# EAGLE design SparkFun_MOSFET_Power_Switch_and_Buck_Regulator_Low-Side (EAGLE 9.6.2)
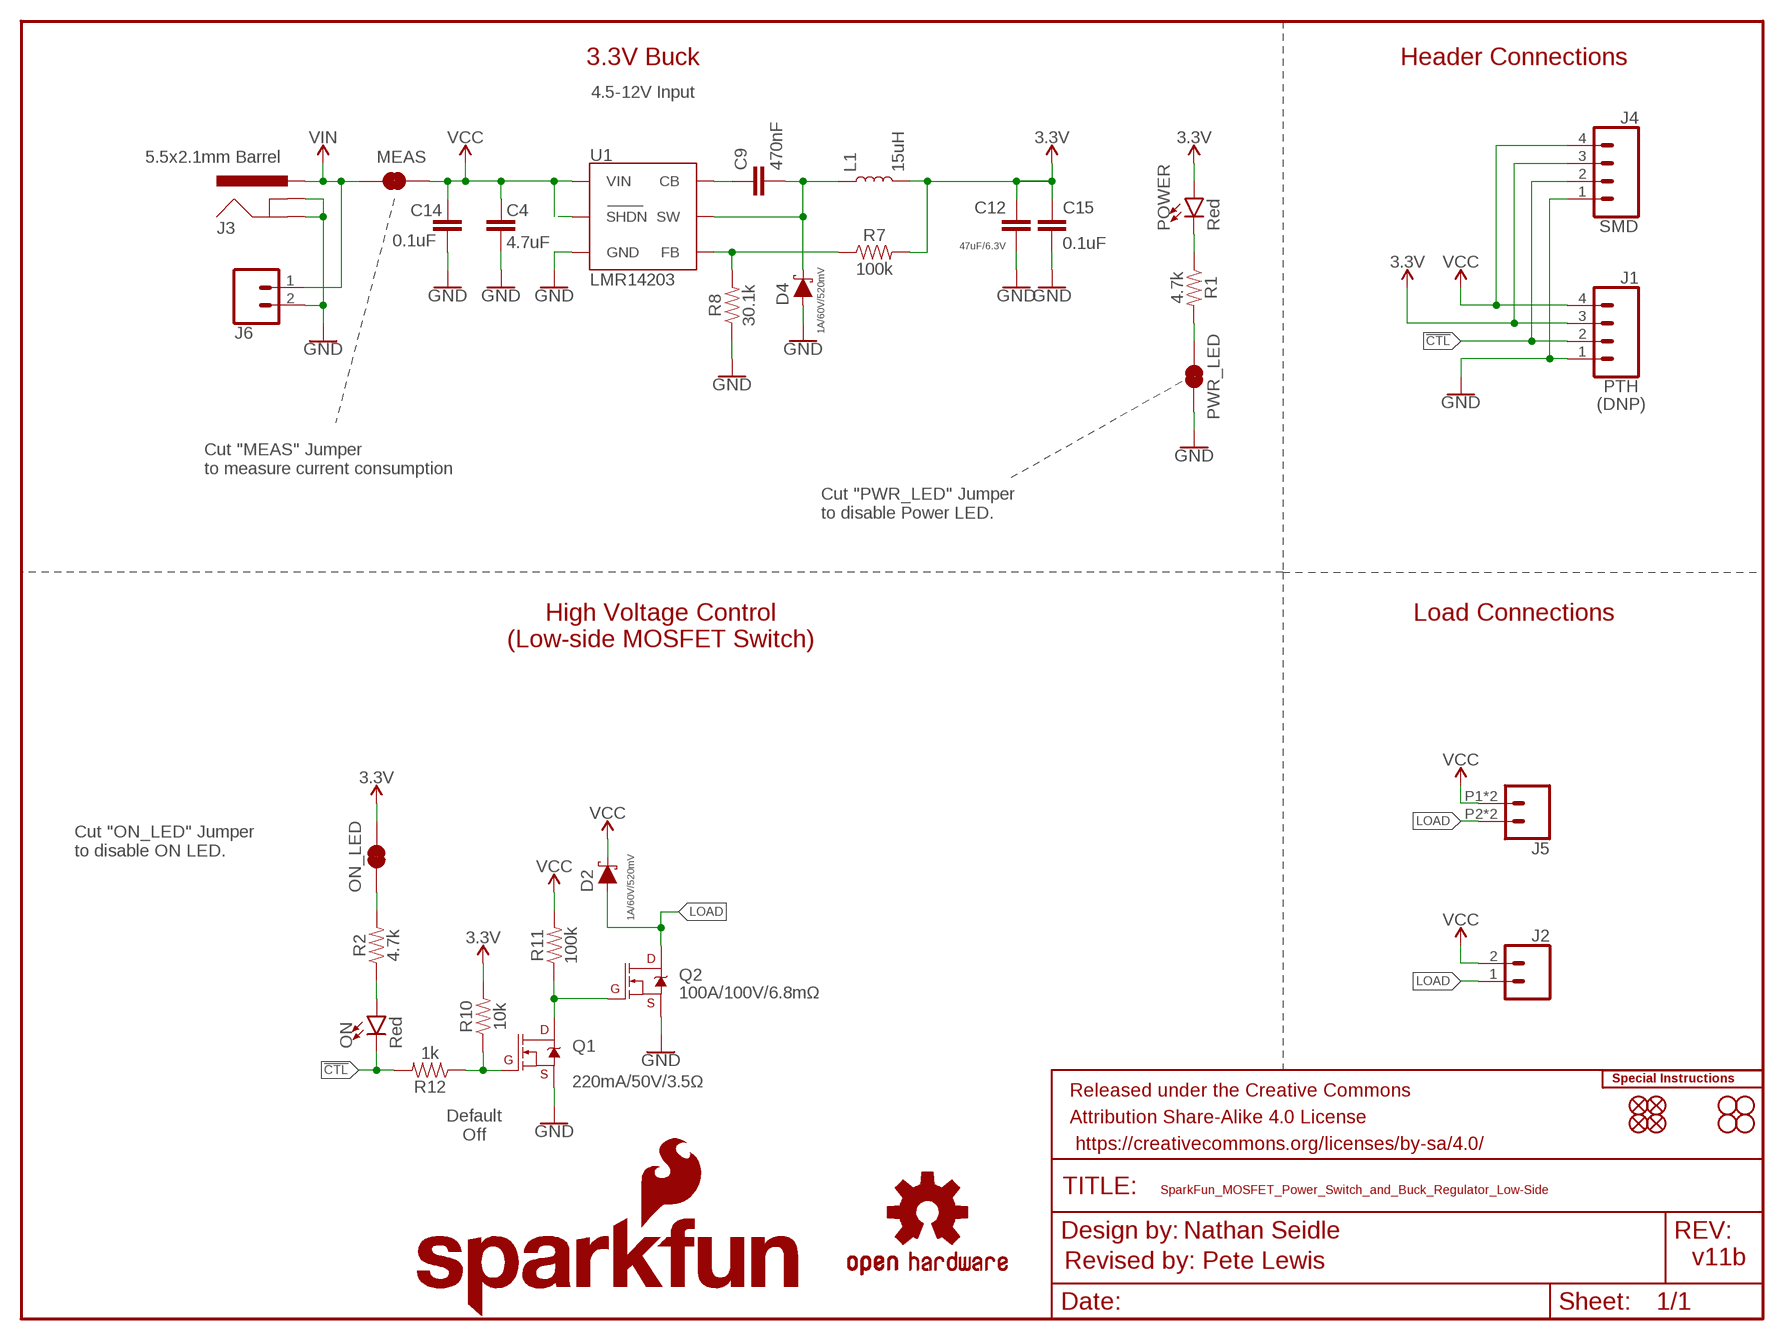
[diagram p0: schematic, sheet 1]

## Parts
C4  4.7uF  4.7UF-0603-35V-(20%)  [0603]
C9  470nF  470NF-0603-10V-10%-X5R  [0603]
C12  47uF/6.3V  47UF  [0805]
C14  0.1uF  0.1UF-0603-100V-10%  [0603]
C15  0.1uF  0.1UF-0603-100V-10%  [0603]
D2  1A/60V/520mV  DIODE-SCHOTTKY-MSS1P6-M3/89A  [DIODE-MICRO-SMP]
D4  1A/60V/520mV  DIODE-SCHOTTKY-MSS1P6-M3/89A  [DIODE-MICRO-SMP]
FD1  FIDUCIALUFIDUCIAL  [FIDUCIAL-MICRO]
FD2  FIDUCIALUFIDUCIAL  [FIDUCIAL-MICRO]
FD3  FIDUCIALUFIDUCIAL  [FIDUCIAL-MICRO]
FD4  FIDUCIALUFIDUCIAL  [FIDUCIAL-MICRO]
FRAME2  FRAME-LETTER  [CREATIVE_COMMONS]
H1  STAND-OFF  [STAND-OFF]
H2  STAND-OFF  [STAND-OFF]
H3  STAND-OFF  [STAND-OFF]
H4  STAND-OFF  [STAND-OFF]
J1  PTH  CONN_041X04_NO_SILK_NO_POP  [1X04_NO_SILK]
J2  CONN_021X02_NO_SILK  [1X02_NO_SILK]
J3  5.5x2.1mm Barrel  POWER_JACKSMD  [POWER_JACK_SMD]
J4  SMD  CONN_04SMD_STRAIGHT_COMBO  [1X04_SMD_VERTICAL_COMBO]
J5  CONN_02SMALL_POKEHOME  [1X02_POKEHOME]
J6  CONN_021X02_NO_SILK  [1X02_NO_SILK]
L1  15uH  INDUCTOR-LHQ32-15UH  [INDUCTOR_LQH32]
LOGO1  OSHW-LOGOM  [OSHW-LOGO-M]
LOGO2  SFE_LOGO_NAME_FLAME.2_INCH  [SFE_LOGO_NAME_FLAME_.2]
LOGO3  SPECIAL_INSTRUCTIONS-ORDERING  [ORDERING_INSTRUCTIONS]
MEAS  JUMPER-COMBO_2_NC_TRACE  [COMBO-JUMPER_2_NC_TRACE]
ON  Red  LED-RED_0603-KB  [LED-0603]
ON_LED  JUMPER-SMT_2_NC_TRACE_SILK  [SMT-JUMPER_2_NC_TRACE_SILK]
POWER  Red  LED-RED_0603-KB  [LED-0603]
PWR_LED  JUMPER-SMT_2_NC_TRACE_SILK  [SMT-JUMPER_2_NC_TRACE_SILK]
Q1  220mA/50V/3.5Ω  MOSFET-NCH-BSS138  [SOT23-3]
Q2  100A/100V/6.8mΩ  MOSFET-NCH-PSMN7R0  [TO-263/D2PAK]
R1  4.7k  4.7KOHM-0603-1/10W-1%  [0603]
R2  4.7k  4.7KOHM-0603-1/10W-1%  [0603]
R7  100k  100KOHM-0603-1/10W-1%  [0603]
R8  30.1k  30.1KOHM-0603-1/10W-1%  [0603]
R10  10k  10KOHM-0603-1/10W-1%  [0603]
R11  100k  100KOHM-0603-1/10W-1%  [0603]
R12  1k  1KOHM-0603-1/10W-1%  [0603]
U1  LMR14203  [SOT23-6]

## Nets
3.3V: C12.1 C15.1 J1.3 J4.3 L1.P$2 ON_LED.2 POWER.A R7.2 R10.2
!CTL: J1.2 J4.2 ON.C R12.2
GND [power]: C4.2 C12.2 C14.2 C15.2 D4.A J1.1 J3.GND(GNDBREAK) J3.P$4(GND) J4.1 J6.2 PWR_LED.1 Q1.2(S) Q2.3(S) R8.1 U1.2(GND)
LOAD: D2.A J2.1 J5.P2 J5.P4 Q2.2(D)
N$1: Q1.3(D) Q2.1(G) R11.1
N$2: ON.A R2.1
N$3: POWER.C R1.1
N$5: R7.1 R8.2 U1.3(FB)
N$6 [power]: PWR_LED.2 R1.2
N$7: ON_LED.1 R2.2
N$10: C9.1 U1.1(CB)
N$12: Q1.1(G) R10.1 R12.1
VCC: C4.1 C14.1 D2.C J1.4 J2.2 J4.4 J5.P1 J5.P3 MEAS.2 MEAS.4 R11.2 U1.4(SHDN) U1.5(VIN)
VIN: J3.VIN0(PWR) J6.1 MEAS.1 MEAS.3
VSW: C9.2 D4.C L1.P$1 U1.6(SW)

## Notes on the sheet
- 3.3V Buck | Header Connections
- 4.5-12V Input
- (DNP)
- Cut "MEAS" Jumper 
  to measure current consumption
- Cut "PWR_LED" Jumper 
  to disable Power LED.
- High Voltage Control
  (Low-side MOSFET Switch)
- Load Connections
- Cut "ON_LED" Jumper 
  to disable ON LED.
- Default
  Off
- Nathan Seidle
- Revised by: Pete Lewis | v11b

## Library data of the parts
C4 = SparkFun-Capacitors:4.7UF: 4.7µF ceramic capacitors A capacitor is a passive two-terminal electrical component used to store electrical energy temporarily in an electric field.; PROD_ID: CAP-14106
C9 = SparkFun-Capacitors:470NF: 0.47uF/470nF ceramic capacitors A capacitor is a passive two-terminal electrical component used to store electrical energy temporarily in an electric field.; PROD_ID: CAP-13216
C12 = SparkFun-Capacitors:47UF; PROD_ID: CAP-13854
C14 C15 = SparkFun-Capacitors:0.1UF: 0.1µF ceramic capacitors A capacitor is a passive two-terminal electrical component used to store electrical energy temporarily in an electric field.; PROD_ID: CAP-08390
D2 D4 = SparkFun-DiscreteSemi:DIODE-SCHOTTKY: Schottky diode A Schottky diode is a semiconductor diode which has a low forward voltage drop and a very fast switching action.; PROD_ID: DIO-13919
FD1-FD4 = SparkFun-Aesthetics:FIDUCIAL: Fiducial Alignment Points Point-of-reference for pick-and-place machines and other optical instruments.
FRAME2 = SparkFun-Aesthetics:FRAME-LETTER: Schematic Frame - Letter Standard 8.5x11 US Letter frame
H1-H4 = SparkFun-Hardware:STAND-OFF: Stand Off Drill holes for mechanically mounting via screws, standoffs, etc. Note: Use the keepout ring to avoid running the screw head into surrounding components. Variant Overviews STAND-OFF - Mechanical footprint for a #4 phillips button head screw. STAND-OFF-TIGHT - Mechanical footprint for a #4 phillips button head screw, Example SparkFun Products Screw - Phillips Head (1/4", 4-40, 10 pack) <https://www.sparkfun.com/products/10453> (PRT-10453) Screw - Phillips Head (1/2", 4-40, 10 pack) <https://www.sparkfun.com/products/10452> (PRT-10452) Screw - Phillips Head (3/4", 4-40, 10 pack) <https://www.sparkfun.com/products/10451> (PRT-10451) Screw - Phillips Head (1", 4-40, 10 pack) <https://www.sparkfun.com/products/10450> (PRT-10450)
J1 = SparkFun-Connectors:CONN_04: Multi connection point. Often used as Generic Header-pin footprint for 0.1 inch spaced/style header connections On any of the 0.1 inch spaced packages, you can populate with these: Break Away Headers - Straight <https://www.sparkfun.com/products/116> (PRT-00116) Break Away Male Headers - Right Angle <https://www.sparkfun.com/products/553> (PRT-00553) Female Headers <https://www.sparkfun.com/products/115> (PRT-00115) Break Away Headers - Machine Pin <https://www.sparkfun.com/products/117> (PRT-00117) Break Away Female Headers - Swiss Machine Pin <https://www.sparkfun.com/products/743> (PRT-00743) For SCREWTERMINALS and SPRING TERMINALS visit here: Screw Terimnals on SparkFun.com <https://www.sparkfun.com/search/results?term=Screw+Terminals> (5mm/3.5mm/2.54mm spacing) This device is also useful as a general connection point to wire up your design to another part of your project. Our various solder wires solder well into these plated through hole pads. Hook-Up Wire - Assortment (Stranded, 22 AWG) <https://www.sparkfun.com/products/11375> (PRT-11375) Hook-Up Wire - Assortment (Solid Core, 22 AWG) <https://www.sparkfun.com/products/11367> (PRT-11367) View the entire wire category on our website here <https://www.sparkfun.com/categories/141> Special notes: Molex polarized connector foot print use with SKU : PRT-08231 with associated crimp pins and housings. 1MM SMD Version SKU: PRT-10208
J2 J6 = SparkFun-Connectors:CONN_02: Multi connection point. Often used as Generic Header-pin footprint for 0.1 inch spaced/style header connections On any of the 0.1 inch spaced packages, you can populate with these: Break Away Headers - Straight <https://www.sparkfun.com/products/116> (PRT-00116) Break Away Male Headers - Right Angle <https://www.sparkfun.com/products/553> (PRT-00553) Female Headers <https://www.sparkfun.com/products/115> (PRT-00115) Break Away Headers - Machine Pin <https://www.sparkfun.com/products/117> (PRT-00117) Break Away Female Headers - Swiss Machine Pin <https://www.sparkfun.com/products/743> (PRT-00743) For SCREWTERMINALS and SPRING TERMINALS visit here: Screw Terimnals on SparkFun.com <https://www.sparkfun.com/search/results?term=Screw+Terminals> (5mm/3.5mm/2.54mm spacing) This device is also useful as a general connection point to wire up your design to another part of your project. Our various solder wires solder well into these plated through hole pads. Hook-Up Wire - Assortment (Stranded, 22 AWG) <https://www.sparkfun.com/products/11375> (PRT-11375) Hook-Up Wire - Assortment (Solid Core, 22 AWG) <https://www.sparkfun.com/products/11367> (PRT-11367) View the entire wire category on our website here <https://www.sparkfun.com/categories/141> Special notes: Molex polarized connector foot print use with: PRT-08233 with associated crimp pins and housings. 2.54_SCREWTERM for use with PRT-10571. 3.5mm Screw Terminal footprints for PRT-08084 5mm Screw Terminal footprints for use with PRT-08432
J3 = SparkFun-Connectors:POWER_JACK: Power Jack Connector This is the standard 5.5mm barrel jack for power. The PTH is the most common, proven, reliable, footprint. The Slot footprint only works if the mill layer is transmitted to the PCB fab house so be warned. Here are the connectors we sell at SparkFun: DC Barrel Power Jack/Connector <https://www.sparkfun.com/products/119> (PRT-00119) DC Barrel Power Jack/Connector (SMD) <https://www.sparkfun.com/products/12748> (PRT-12748) DC Barrel Jack Adapter - Breadboard Compatible <https://www.sparkfun.com/products/10811> (PRT-10811) It is used on this SparkFun product (and many, many others): SparkFun RedBoard - Programmed with Arduino <https://www.sparkfun.com/products/12757> (DEV-12757) Also, if you need a mating power supply or connector, please check these out: Wall Adapter Power Supply - 9VDC 650mA <https://www.sparkfun.com/products/298> (TOL-00298) DC Barrel Jack Adapter - Male <https://www.sparkfun.com/products/10287> (PRT-10287); PROD_ID: CONN-08106; SF_ID: PRT-12748
J4 = SparkFun-Connectors:CONN_04: Multi connection point. Often used as Generic Header-pin footprint for 0.1 inch spaced/style header connections On any of the 0.1 inch spaced packages, you can populate with these: Break Away Headers - Straight <https://www.sparkfun.com/products/116> (PRT-00116) Break Away Male Headers - Right Angle <https://www.sparkfun.com/products/553> (PRT-00553) Female Headers <https://www.sparkfun.com/products/115> (PRT-00115) Break Away Headers - Machine Pin <https://www.sparkfun.com/products/117> (PRT-00117) Break Away Female Headers - Swiss Machine Pin <https://www.sparkfun.com/products/743> (PRT-00743) For SCREWTERMINALS and SPRING TERMINALS visit here: Screw Terimnals on SparkFun.com <https://www.sparkfun.com/search/results?term=Screw+Terminals> (5mm/3.5mm/2.54mm spacing) This device is also useful as a general connection point to wire up your design to another part of your project. Our various solder wires solder well into these plated through hole pads. Hook-Up Wire - Assortment (Stranded, 22 AWG) <https://www.sparkfun.com/products/11375> (PRT-11375) Hook-Up Wire - Assortment (Solid Core, 22 AWG) <https://www.sparkfun.com/products/11367> (PRT-11367) View the entire wire category on our website here <https://www.sparkfun.com/categories/141> Special notes: Molex polarized connector foot print use with SKU : PRT-08231 with associated crimp pins and housings. 1MM SMD Version SKU: PRT-10208; PROD_ID: CONN-08511; VALUE: 1X04_SMD_STRAIGHT_COMBO
J5 = SparkFun-Connectors:CONN_02: Multi connection point. Often used as Generic Header-pin footprint for 0.1 inch spaced/style header connections On any of the 0.1 inch spaced packages, you can populate with these: Break Away Headers - Straight <https://www.sparkfun.com/products/116> (PRT-00116) Break Away Male Headers - Right Angle <https://www.sparkfun.com/products/553> (PRT-00553) Female Headers <https://www.sparkfun.com/products/115> (PRT-00115) Break Away Headers - Machine Pin <https://www.sparkfun.com/products/117> (PRT-00117) Break Away Female Headers - Swiss Machine Pin <https://www.sparkfun.com/products/743> (PRT-00743) For SCREWTERMINALS and SPRING TERMINALS visit here: Screw Terimnals on SparkFun.com <https://www.sparkfun.com/search/results?term=Screw+Terminals> (5mm/3.5mm/2.54mm spacing) This device is also useful as a general connection point to wire up your design to another part of your project. Our various solder wires solder well into these plated through hole pads. Hook-Up Wire - Assortment (Stranded, 22 AWG) <https://www.sparkfun.com/products/11375> (PRT-11375) Hook-Up Wire - Assortment (Solid Core, 22 AWG) <https://www.sparkfun.com/products/11367> (PRT-11367) View the entire wire category on our website here <https://www.sparkfun.com/categories/141> Special notes: Molex polarized connector foot print use with: PRT-08233 with associated crimp pins and housings. 2.54_SCREWTERM for use with PRT-10571. 3.5mm Screw Terminal footprints for PRT-08084 5mm Screw Terminal footprints for use with PRT-08432; PROD_ID: CONN-13512
L1 = SparkFun-Coils:INDUCTOR: Inductors Resist changes in electrical current. Basically a coil of wire. SparkFun Products: SparkFun Load Cell Amplifier - HX711 <https://www.sparkfun.com/products/13879> IOIO-OTG - V2.2 <https://www.sparkfun.com/products/13613>; PROD_ID: NDUC-14107
LOGO1 = SparkFun-Aesthetics:OSHW-LOGO: Open-Source Hardware (OSHW) Logo This logo indicates the piece of hardware it is found on incorporates a OSHW license and/or adheres to the definition of open source hardware found here: http://freedomdefined.org/OSHW
LOGO2 = SparkFun-Aesthetics:SFE_LOGO_NAME_FLAME: SparkFun Font Logo w/ Flame This is the SparkFun full logo. The logo on the schematic will always be the same size; the package variant is the height of the flame part of the logo. Default layer for the logo on the board is tSilk.
LOGO3 = SparkFun-Aesthetics:SPECIAL_INSTRUCTIONS: Special Ordering/Production Instructions Alert Symbol for special PCB ordering instructions or unique production process warnings. Ordering Instructions Production Instructions Types of information that should be added to box: Copper weight Soldermask color Silk color PCB thickness Number of layers PCB Standard: 1.6mm FR4 1 oz copper immersion silver plating red soldermask white silkscreen Types of information that should be added to box: Special wash requirements Depaneling instructions Humidification Glue curing Default text settings: 0.07 inch 9% ratio 50% line distance
MEAS = SparkFun-Jumpers:JUMPER-COMBO_2_NC_TRACE
ON POWER = SparkFun-LED:LED-RED: Red SMD LED Used in manufacturing of most products at SparkFun Packages: 0603 - KB - KingBright (DIO-17976) SMD 0603 package [Datasheet] <https://www.kingbrightusa.com/images/catalog/SPEC/APT1608SURCK.pdf> 0603 - (DIO-00819, has gone EOL) SMD 0603 package 0603 SMART - SMD 0603 SMART package ( more efficient and expensive)[Product Link] <http://www.osram-os.com/Graphics/XPic2/00077099_0.pdf> 1206 - SMD1206 package [Product Link] <https://www.sparkfun.com/datasheets/DevTools/LilyPad/Q150OVS4.pdff> SparkFun Products: Pro Mini 328 -5V <https://www.sparkfun.com/products/821> RedBoard <https://www.sparkfun.com/products/12757> IOIO-OTG <https://www.sparkfun.com/products/13613>; PROD_ID: DIO-17976
ON_LED PWR_LED = SparkFun-Jumpers:JUMPER-SMT_2_NC_TRACE: Normally closed trace jumper This jumper has a trace between two pads so it's normally closed (NC). Use a razor knife to open the connection. For best results follow the IPC guidelines for cutting traces: Cutout at least 0.063 mm (0.005 in). Remove all loose material to clean up the cut area. Seal the cut with an approved epoxy. Reapply solder to reclose the connection.
Q1 = SparkFun-DiscreteSemi:MOSFET-NCH: N-channel MOSFETs Voltage controlled devices that allow control of high current outputs. SparkFun Products: SparkFun OpenScale <https://www.sparkfun.com/products/13261> SparkFun Digital Sandbox <https://www.sparkfun.com/products/12651> SparkFun Monster Moto Shield <https://www.sparkfun.com/products/10182> SparkFun MOSFET Power Controller <https://www.sparkfun.com/products/11214>; PROD_ID: TRANS-00830
Q2 = SparkFun-DiscreteSemi:MOSFET-NCH: N-channel MOSFETs Voltage controlled devices that allow control of high current outputs. SparkFun Products: SparkFun OpenScale <https://www.sparkfun.com/products/13261> SparkFun Digital Sandbox <https://www.sparkfun.com/products/12651> SparkFun Monster Moto Shield <https://www.sparkfun.com/products/10182> SparkFun MOSFET Power Controller <https://www.sparkfun.com/products/11214>; PROD_ID: TRANS-12437
R1 R2 = SparkFun-Resistors:4.7KOHM: 4.7kΩ resistor A resistor is a passive two-terminal electrical component that implements electrical resistance as a circuit element. Resistors act to reduce current flow, and, at the same time, act to lower voltage levels within circuits. - Wikipedia; PROD_ID: RES-07857
R7 R11 = SparkFun-Resistors:100KOHM: 100kΩ resistor A resistor is a passive two-terminal electrical component that implements electrical resistance as a circuit element. Resistors act to reduce current flow, and, at the same time, act to lower voltage levels within circuits. - Wikipedia; PROD_ID: RES-07828
R8 = SparkFun-Resistors:30.1KOHM: 30.1kΩ resistor A resistor is a passive two-terminal electrical component that implements electrical resistance as a circuit element. Resistors act to reduce current flow, and, at the same time, act to lower voltage levels within circuits. - Wikipedia; PROD_ID: RES-14690
R10 = SparkFun-Resistors:10KOHM: 10kΩ resistor A resistor is a passive two-terminal electrical component that implements electrical resistance as a circuit element. Resistors act to reduce current flow, and, at the same time, act to lower voltage levels within circuits. - Wikipedia; PROD_ID: RES-00824
R12 = SparkFun-Resistors:1KOHM: 1kΩ resistor A resistor is a passive two-terminal electrical component that implements electrical resistance as a circuit element. Resistors act to reduce current flow, and, at the same time, act to lower voltage levels within circuits. - Wikipedia; PROD_ID: RES-07856
U1 = SparkFun-IC-Power:LMR14203; PROD_ID: IC-13918

## Net classes
1 power: width 0.254 mm

## Board
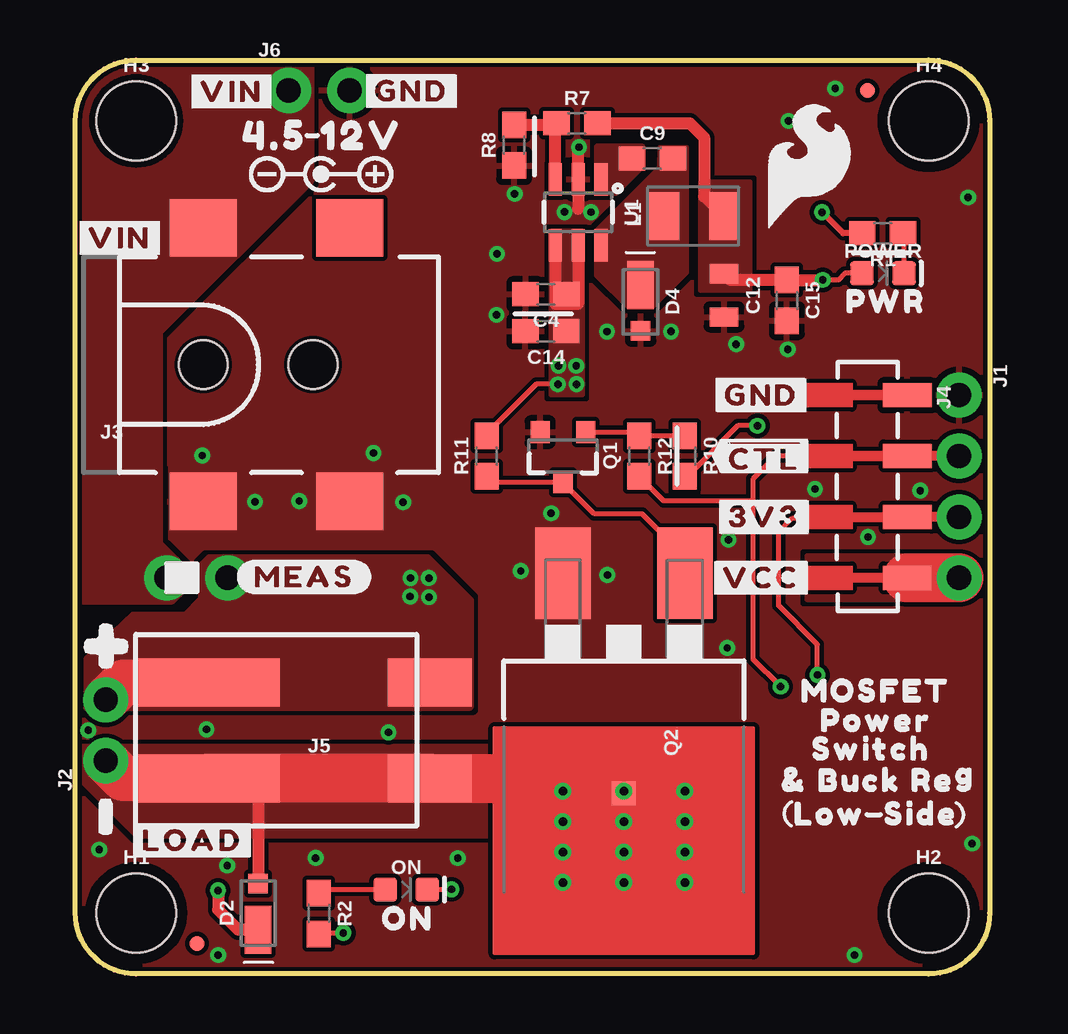
[diagram p1: board, top side]
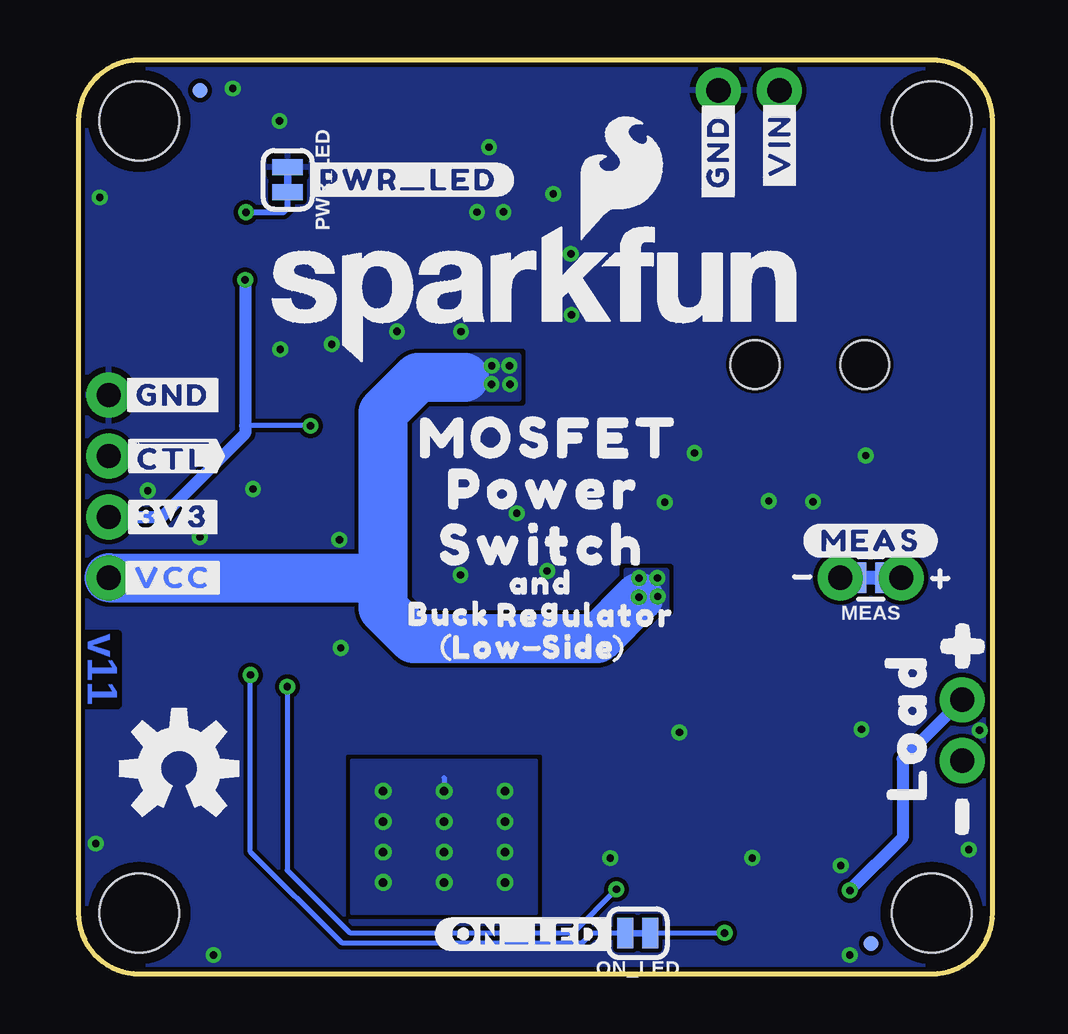
[diagram p2: board, bottom side, seen from below]

Size 38.1 x 38.1 mm. Coordinates in mm from the lower left corner, seen from the top.
Outline: 0,2.54 0,35.56 arc-90 2.54,38.1 35.56,38.1 arc-90 38.1,35.56 38.1,2.54 arc-90 35.56,0 2.54,0 arc-90 0,2.54
Copper layers (1*16): Top 0.035mm / dielectric 1.5mm / Bottom 0.035mm
Design rules "SparkFun-2-Layer-General-JLCPCB": minimum track width 7mil, minimum drill 0.3mm, track to track 7mil, track to pad 7mil, pad to pad 7mil, via to via 7mil, smd to smd 7mil, copper to edge 7mil, drill to drill 7mil, minimum pad ring 7mil, minimum via ring 7mil, stop-mask expansion 3mil, vias tented up to drill 25mil, thermal gap 10mil

### Footprints (pad centres in the part's own frame; a part is rotated, then mirrored left to right if it is on the bottom)
0603 = smd 1.1 x 1: 1 -0.85,0; 2 0.85,0
0805 = smd 0.8 x 1.2: 1 -0.9,0; 2 0.9,0
DIODE-MICRO-SMP = smd 0.813 x 0.813: A 1.219,0 | smd 2.007 x 1.102: C -0.699,0
FIDUCIAL-MICRO = smd 0.635 x 0.635: 1 0,0
STAND-OFF = hole 3.302: 0,0
1X04_NO_SILK = drill 1.016 pad 1.88: 1 0,0; 2 2.54,0; 3 5.08,0; 4 7.62,0
1X02_NO_SILK = drill 1.016 pad 1.88: 1 0,0; 2 2.54,0
POWER_JACK_SMD = smd 2.8 x 2.4: GND 0,-5.7; P$4 6.1,-5.7; VIN0 0,5.7; VIN1 6.1,5.7 | hole 2.032: 0,0; 4.572,0
1X04_SMD_VERTICAL_COMBO = smd 1 x 2: 1 0,1.65; 2 2.54,1.65; 3 5.08,1.65; 4 7.62,1.652
1X02_POKEHOME = smd 3.5 x 2: P1 5.25,2; P2 5.25,-2 | smd 6 x 2: P3 -4,2; P4 -4,-2
INDUCTOR_LQH32 = smd 2 x 1.25: P$1 -0.07,1.205; P$2 -0.07,-1.295
COMBO-JUMPER_2_NC_TRACE = smd 0.635 x 1.27: 1 -0.508,0; 2 0.508,0 | drill 1.016 pad 1.88: 3 -1.27,0; 4 1.27,0
LED-0603 = smd 1 x 1: A -0.877,0; C 0.877,0
SMT-JUMPER_2_NC_TRACE_SILK = smd 0.66 x 1.27: 1 -0.521,0; 2 0.521,0
SOT23-3 = smd 0.8 x 0.9: 1 -0.95,-1; 2 0.95,-1; 3 0,1.1
TO-263/D2PAK = smd 2.32 x 3.81: 1 -2.54,-7.045; 3 2.54,-7.045 | smd 1 x 1: 2 0,2.125
SOT23-6 = smd 0.55 x 1.35: 1 -0.95,-1.375; 2 0,-1.375; 3 0.95,-1.375; 4 0.95,1.375; 5 0,1.375; 6 -0.95,1.375

### Placement (x,y rotation side)
C4  19.61,28.33 180 top
C9  24.05,33.99 0 top
C12  27.04,28.29 270 top
C14  19.61,26.79 180 top
C15  29.65,28.08 270 top
D2  7.62,2.54 90 top
D4  23.55,28.02 270 top
FD1  5.08,1.27 0 bottom
FD2  5.08,1.27 0 top
FD3  33.02,36.83 0 bottom
FD4  33.02,36.83 0 top
FRAME2  -10.16,-12.7 0 top  (outside the outline)
H1  2.54,2.54 0 top
H2  35.56,2.54 0 top
H3  2.54,35.56 0 top
H4  35.56,35.56 0 top
J1  36.83,24.13 270 top
J2  1.27,8.89 90 top
J3  5.33,25.4 0 top
J4  33.02,24.13 270 top
J5  9.53,10.16 0 top
J6  8.89,36.83 0 top
L1  25.75,31.65 90 top
LOGO1  33.9,8.56 0 bottom
LOGO2  19.03,28.35 0 bottom
LOGO3  64.77,50.8 0 top  (outside the outline)
MEAS  5.08,16.51 180 bottom
ON  13.79,3.52 0 top
ON_LED  14.79,1.69 180 bottom
POWER  33.66,29.21 0 top
PWR_LED  29.38,33.1 270 bottom
Q1  20.32,21.59 180 top
Q2  22.86,9.65 180 top
R1  33.64,30.87 180 top
R2  10.15,2.52 270 top
R7  20.9,35.46 0 top
R8  18.28,34.55 90 top
R10  25.4,21.59 270 top
R11  17.14,21.59 90 top
R12  23.5,21.59 270 top
U1  20.95,31.75 180 top
U$1  [#LOAD#7]  4.87,5.57 0 top
U$2  [MOSFET0]  33.35,11.8 0 top
U$3  [#VIN#8]  1.85,30.68 0 top
U$4  [#GND#0]  28.57,24.13 0 top
U$6  [#GND#0]  14.01,36.8 0 top
U$8  [SFE_LOGO_FLAME_.2]  30.58,33.66 0 top
U$9  [POWER1]  33.36,10.57 0 top
U$10  [#0]  1.27,13.46 270 top
U$11  [#1]  1.27,6.35 270 top
U$12  [#GND#0]  34.16,24.13 0 bottom
U$13  [SWITCH2]  33.15,9.38 0 top
U$14  [#3V3#3]  28.7,19.05 0 top
U$15  [#PWR_LED#11]  24.35,33.11 0 bottom
U$16  [#ON_LED#13]  19.42,1.66 0 bottom
U$17  [#MEAS#14]  5.09,18.06 0 bottom
U$18  [4#5_12V5]  10.31,34.95 0 top
U$19  [LOAD0]  3.57,10.3 90 bottom
U$20  [#0]  1.27,13.46 270 bottom
U$21  [#VIN#8]  6.5,36.78 0 top
U$22  [#1]  1.27,6.35 270 bottom
U$23  [LOW0]  31.43,6.68 0 top
U$24  [MOSFET_0]  18.17,22.34 0 bottom
U$25  [POWER_1]  18.4,20.21 0 bottom
U$26  [SWITCH_2]  18.47,17.87 0 bottom
U$27  [#3V3#3]  34.16,19.05 0 bottom
U$28  [##CTL##1]  28.7,21.59 0 top
U$29  [POLARITY_MARKING_CENTER_POSITIVE#JPG]  10.24,33.34 0 top
U$30  [##CTL##2]  34.16,21.59 0 bottom
U$31  [#VCC#4]  28.57,16.51 0 top
U$32  [#VCC#4]  34.16,16.51 0 bottom
U$33  [SIDE0]  35.24,6.68 0 top
U$34  [PWR9]  33.77,28.04 0 top
U$35  [ON10]  13.85,2.31 0 top
U$36  [#VIN#8]  8.89,34.54 90 bottom
U$37  [#GND#0]  11.44,34.28 90 bottom
U$38  [#MEAS#14]  9.54,16.55 0 top
U$39  [BUCK5]  22.64,15 0 bottom
U$40  [REGULATOR6]  16.96,14.95 0 bottom
U$41  [#_BUCK_REG7]  33.46,8.07 0 top
U$42  [AND8]  18.81,16.3 0 bottom
U$43  [LOW0]  21.04,13.62 0 bottom
U$44  [SIDE0]  17.23,13.62 0 bottom

### Tracks (layer width: path | path; a pad name or v marks a point on that pad's centre or on a via)
3.3V  (via drill 0.3)
  Top 0.203: v28.42,22.85 27.61,22.85 25.5,20.74 R10.2 | POWER.A 32.07,29.21 31.79,28.93 v31.15,28.93 | v30.93,12.46 30.93,13.73 29.3,15.35 29.3,18.42 29.88,19 36.78,19 J1.3
  Top 0.406: J1.3 J4.3
  Top 0.508: R7.2 25.61,35.46 26.21,34.86 26.21,32.42 L1.P$2 | C12.1 27.29,28.93 C15.1 v31.15,28.93
  Bottom 0.203: v28.42,22.85 31.15,22.85 | ON_LED.2 16.71,1.69 17.11,1.3 27.12,1.3 30.93,5.1 v30.93,12.46
  Bottom 0.508: J1.3 34.63,19.05 31.15,22.53 31.15,22.85 v31.15,28.93
  pour Top (no thermals): 28.12,33.02 26.04,33.02 26.04,28.48 28.12,28.48
!CTL  (via drill 0.3)
  Top 0.203: ON.C 15.67,3.52 v15.68,3.53 | 28.23,19.72 28.23,20.62 29.2,21.59 J4.2 | 28.23,19.72 28.23,13.13 v29.39,11.98 | R12.2 24.51,19.72 28.23,19.72
  Top 0.406: J1.2 J4.2
  Bottom 0.203: v15.68,3.53 17.48,1.72 26.8,1.72 29.4,4.33 29.4,11.97 v29.39,11.98
GND  (via drill 0.3)
  Top 0.508: v20.99,34.47 20.95,34.43 U1.2 20.95,31.88
  other vias: 12.43,21.71 18.56,16.8 19.83,19.2 22.17,16.63 27.54,26.25 29.68,26.04 21.49,31.76 20.38,31.76 29.72,35.56 5.29,21.61 7.49,19.68 24.82,26.78 22.15,26.77 18.31,32.52 17.57,30.02 17.55,27.48 35.21,20.15 30.82,20.21 13.05,10.07 5.47,10.2 15.94,4.83 32.47,0.79 37.37,5.44 37.2,32.37 31.67,36.91 1,5.18 5.95,0.78 10.02,4.83 33.03,18.22 27.17,13.59 27.22,18.1 9.33,19.72 13.66,19.66 6.33,4.52 0.54,10.16
  pour Top (isolate 0.178, rank 3): 0,38.1 38.1,38.1 38.1,0 0,0
  pour Bottom (isolate 0.178, rank 3): 0,38.1 38.1,38.1 38.1,0 0,0
  pour Top (no thermals): 3.95,21.59 3.95,18.17 13.97,18.17 13.97,21.59
  pour Top (no thermals): 22.86,19.05 17.78,19.05 17.78,13.97 22.86,13.97
LOAD  (via drill 0.35)
  Top 0.203: Q2.2 v22.86,7.62
  Top 0.508: J5.P4 7.23,8.16 7.62,7.77 D2.A
  Top 1.905: J5.P4 2,8.16 J2.1
  Top 2.032: J5.P4 J5.P2 22.23,8.16 Q2.2
  Bottom 0.203: 22.86,8.18 v22.86,7.62
  other vias: 25.4,3.81 22.86,3.81 20.32,3.81 20.32,6.35 22.86,6.35 25.4,6.35 25.4,7.62 20.32,7.62 20.32,5.08 22.86,5.08 25.4,5.08
  pour Top (no thermals): 18.41,9.53 0,9.53 0,8.26 2.54,5.71 18.41,5.71
  pour Bottom: 19.05,8.89 19.05,2.54 26.67,2.54 26.67,8.89
N$1
  Top 0.203: R11.1 17.39,20.49 Q1.3 21.63,19.18 23.62,19.18 25.4,17.4 Q2.1
N$2
  Top 0.203: R2.1 10.3,3.52 ON.A
N$3
  Top 0.203: POWER.C 34.53,30.83 R1.1
N$5
  Top 0.178: 20,35.41 R7.1
  Top 0.508: U1.3 20,35.41 R8.2
N$6  (via drill 0.3)
  Top 0.254: R1.2 31.99,30.87 v31.11,31.75
  Bottom 0.254: v31.11,31.75 29.56,31.75 29.38,31.93 PWR_LED.2
N$7  (via drill 0.3)
  Top 0.203: R2.2 10.19,1.71 v11.17,1.71
  Bottom 0.203: ON_LED.1 14.25,1.71 v11.17,1.71
N$10
  pour Top (no thermals): 23.66,34.5 21.72,34.5 21.72,32.54 22.52,32.54 23.66,33.67
N$12
  Top 0.203: Q1.1 23.34,22.59 R12.1 R10.1
VCC  (via drill 0.3)
  Top 0.203: R11.2 17.14,22.53 19.2,24.58 v20.11,24.58
  Top 0.508: U1.4 20,27.94 20.95,27.94 U1.5 | D2.C 6.79,1.84 5.95,2.68 v5.95,3.48
  Top 1.905: J5.P3 2,12.16 J2.2
  Top 2.032: J1.4 J4.4
  Bottom 0.203: v20.88,24.59 21.17,24.87 22,24.87
  Bottom 0.508: MEAS.2 MEAS.4 | J2.2 3.75,8.95 3.75,5.68 v5.95,3.48
  Bottom 2.032: J1.4 25.4,16.51 | v14.74,15.71 16.48,13.97 24.13,13.97 25.4,15.24 25.4,16.51 | 25.4,16.51 25.4,23.42 23.95,24.87 22,24.87
  other vias: 13.97,16.51 14.73,16.5 13.95,15.74 20.14,25.35 20.87,25.35
  pour Top (no thermals): 21.15,30.96 19.82,30.96 19.82,24.15 21.15,24.15
  pour Top (no thermals): 14.71,17.39 5.57,17.39 5.21,17.03 5.21,15.65 4.55,14.99 2.39,14.99 0.43,13.13 0.43,11.07 16.45,11.07 16.53,11.15 16.53,15.57
  pour Bottom: 13.59,16.83 13.59,15.23 15.28,15.23 15.28,16.83
  pour Bottom: 22.23,25.8 19.75,25.8 19.75,23.94 22.23,23.94
  pour Top (no thermals): 35.56,17.43 30.48,17.43 30.48,15.6 35.56,15.6
VIN
  Bottom 0.508: MEAS.1 MEAS.3
  pour Top (no thermals): 0,15.51 4.05,15.51 4.64,16.1 4.64,16.87 3.57,17.94 3.57,26.75 9.87,33.05 9.87,38.07 0,38.07
VSW
  pour Top (no thermals): 21.71,30.98 21.71,29.12 23.05,27.79 24.04,27.79 25.49,29.24 25.49,34.46 24.35,34.46 24.34,33.61

### Text on the board
Bottom: v11
Measures: Units are INCHES
tDocu: 2-Layer Design / Soldermask: Red / Silkscreen: White / Thickness: 1.6mm / Copper Plating: 2 OZ / Surface Finish: Lead-Free HASL / Material: TG155 | Nathan Seidle | Revised by: Pete Lewis